# Altium project EEG.PrjPCB
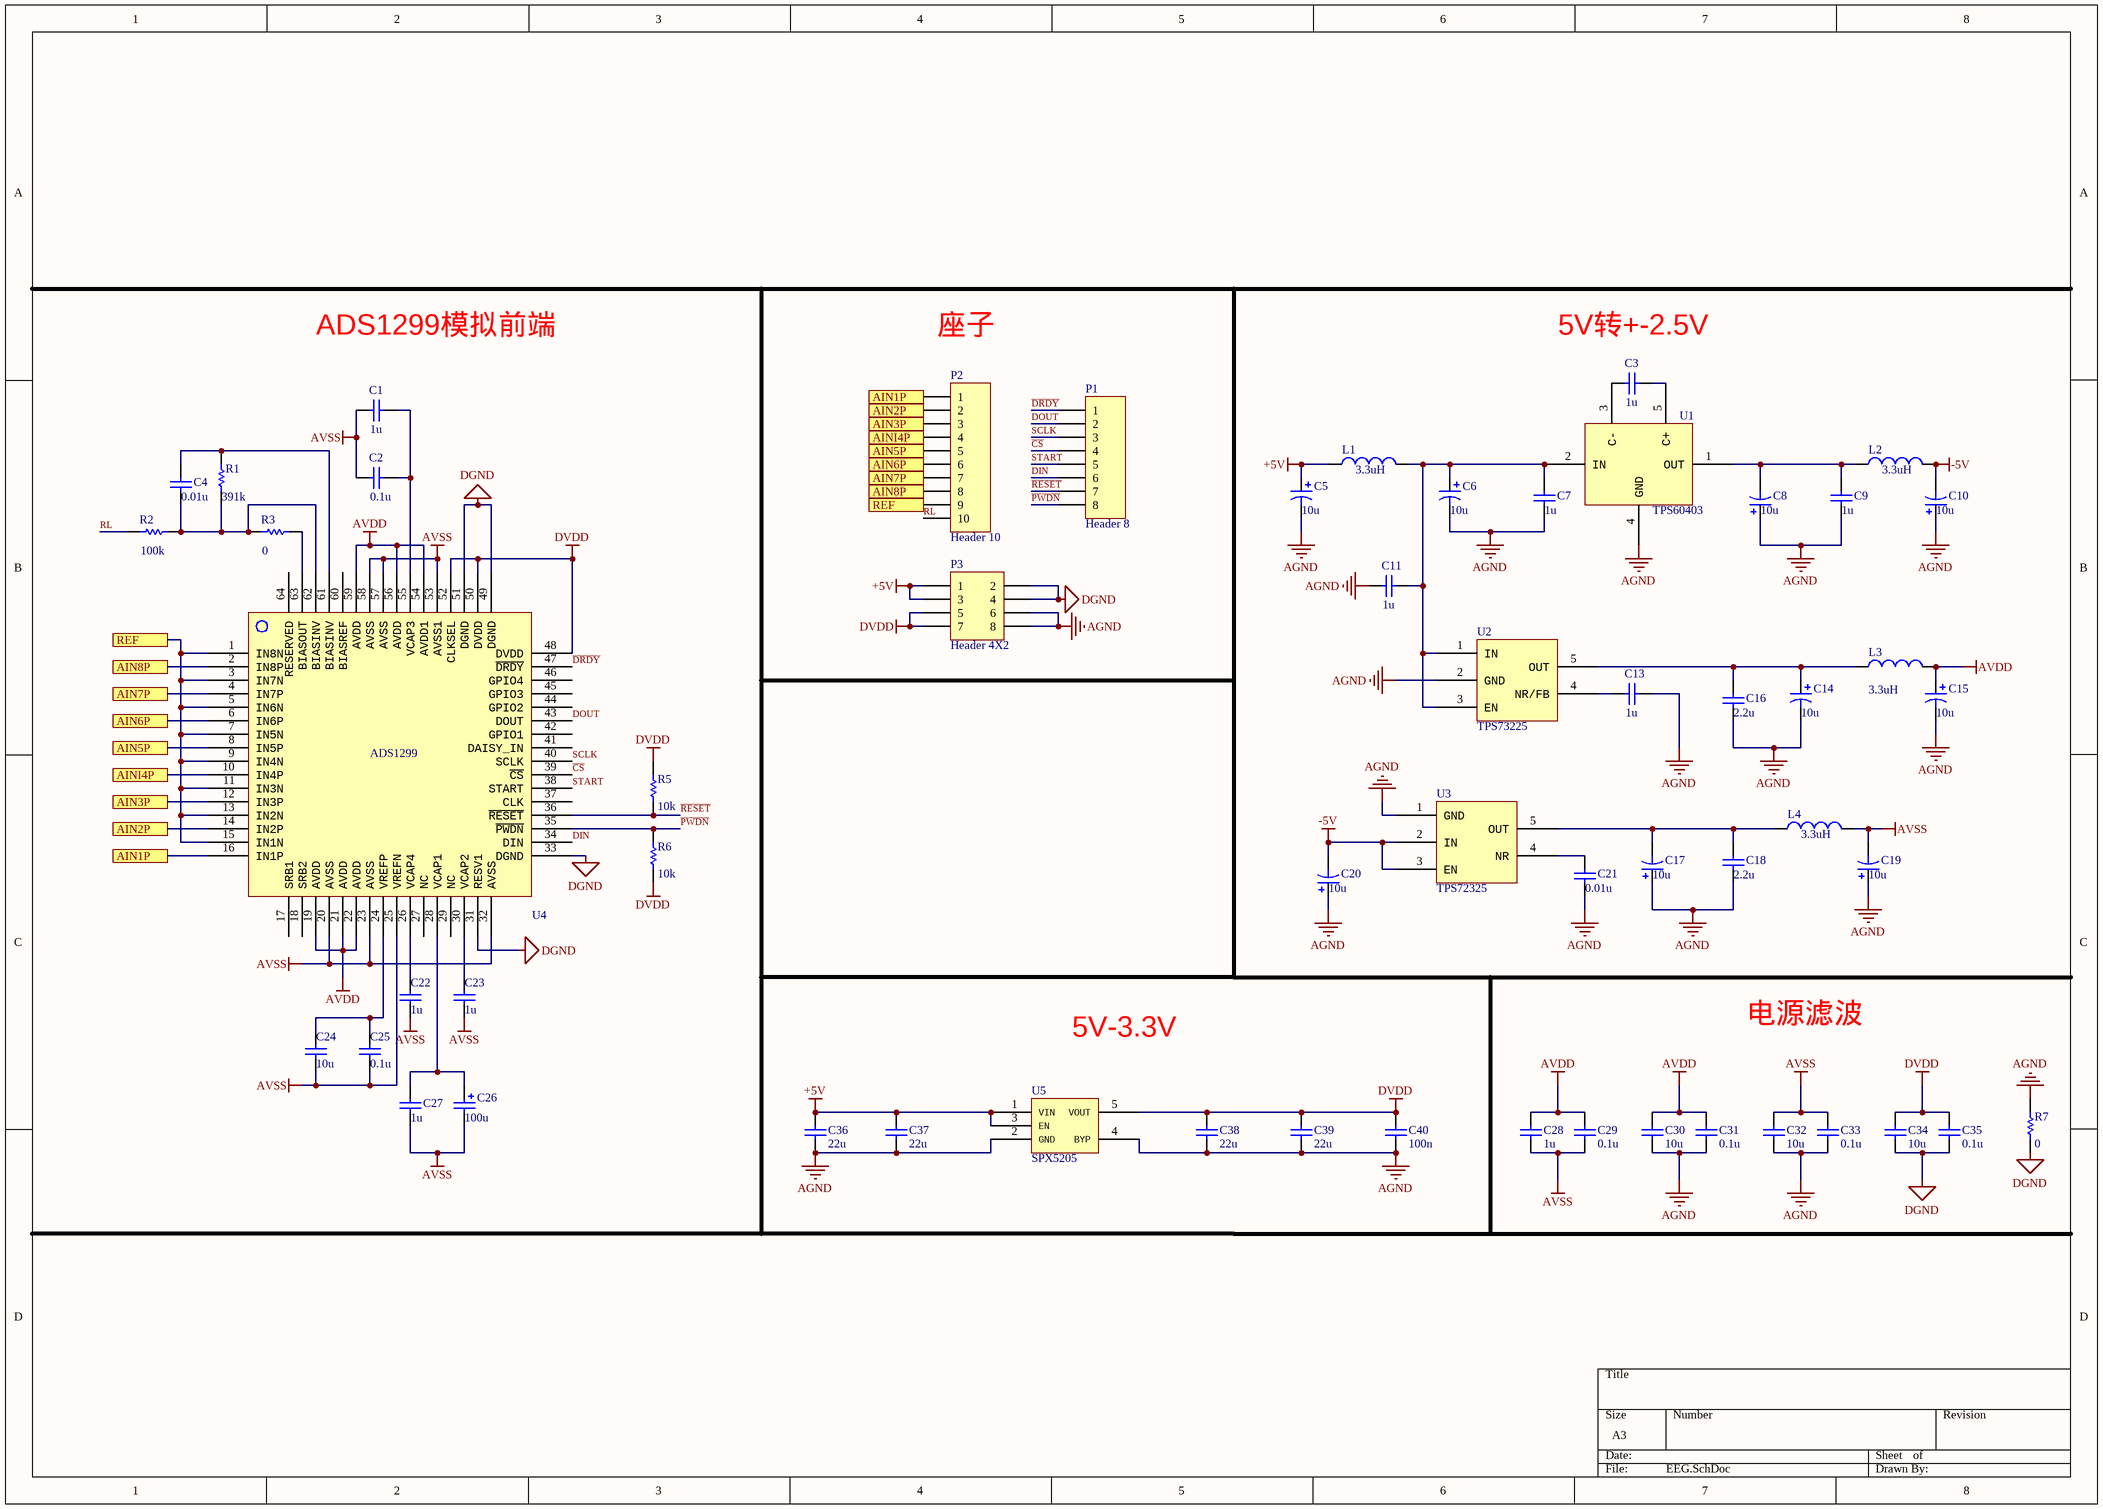
[diagram p0: EEG.SchDoc]
1 sheet, 57 parts. Net scope: flat (ports and power ports of the same name join across sheets).
Board file: EEG.PcbDoc

## Sheet EEG.SchDoc
size A3

### Parts
C1  value 1u  [0603-1]  (hidden comment: Cap)
C2  value 0.1u  [0603-1]  (hidden comment: Cap)
C3  value 1u  [0603-1]  (hidden comment: Cap)
C4  value 0.01u  [0603-1]  (hidden comment: Cap)
C5  value 10u  [0603-1]  (hidden comment: Cap Pol1)
C6  value 10u  [0603-1]  (hidden comment: Cap Pol1)
C7  value 1u  [0603-1]  (hidden comment: Cap)
C8  value 10u  [0603-1]  (hidden comment: Cap Pol1)
C9  value 1u  [0603-1]  (hidden comment: Cap)
C10  value 10u  [0603-1]  (hidden comment: Cap Pol1)
C11  value 1u  [0603-1]  (hidden comment: Cap)
C13  value 1u  [0603-1]  (hidden comment: Cap)
C14  value 10u  [0603-1]  (hidden comment: Cap Pol1)
C15  value 10u  [0603-1]  (hidden comment: Cap Pol1)
C16  value 2.2u  [0603-1]  (hidden comment: Cap)
C17  value 10u  [0603-1]  (hidden comment: Cap Pol1)
C18  value 2.2u  [0603-1]  (hidden comment: Cap)
C19  value 10u  [0603-1]  (hidden comment: Cap Pol1)
C20  value 10u  [0603-1]  (hidden comment: Cap Pol1)
C21  value 0.01u  [0603-1]  (hidden comment: Cap)
C22  value 1u  [0603-1]  (hidden comment: Cap)
C23  value 1u  [0603-1]  (hidden comment: Cap)
C24  value 10u  [0603-1]  (hidden comment: Cap)
C25  value 0.1u  [0603-1]  (hidden comment: Cap)
C26  value 100u  [0603-1]  (hidden comment: Cap Pol2)
C27  value 1u  [0603-1]  (hidden comment: Cap)
C28  value 1u  [0603-1]  (hidden comment: Cap)
C29  value 0.1u  [0603-1]  (hidden comment: Cap)
C30  value 10u  [0603-1]  (hidden comment: Cap)
C31  value 0.1u  [0603-1]  (hidden comment: Cap)
C32  value 10u  [0603-1]  (hidden comment: Cap)
C33  value 0.1u  [0603-1]  (hidden comment: Cap)
C34  value 10u  [0603-1]  (hidden comment: Cap)
C35  value 0.1u  [0603-1]  (hidden comment: Cap)
C36  value 22u  [0603-1]  (hidden comment: Cap)
C37  value 22u  [0603-1]  (hidden comment: Cap)
C38  value 22u  [0603-1]  (hidden comment: Cap)
C39  value 22u  [0603-1]  (hidden comment: Cap)
C40  value 100n  [0603-1]  (hidden comment: Cap)
L1  value 3.3uH  [L-SMD-7]  (hidden comment: Inductor)
L2  value 3.3uH  [L-SMD-7]  (hidden comment: Inductor)
L3  value 3.3uH  [L-SMD-7]  (hidden comment: Inductor)
L4  value 3.3uH  [L-SMD-7]  (hidden comment: Inductor)
P1  Header 8  [HDR1X8]
P2  Header 10  [HDR1X10]
P3  Header 4X2  [HDR2X4]
R1  value 391k  [0603-1]  (hidden comment: Res1)
R2  value 100k  [0603-1]  (hidden comment: Res1)
R3  value 0  [0603-1]  (hidden comment: Res1)
R5  value 10k  [0603-1]  (hidden comment: Res1)
R6  value 10k  [0603-1]  (hidden comment: Res1)
R7  value 0  [0603-1]  (hidden comment: Res1)
U1  TPS60403  [tps723/732/60403]
U2  TPS73225  [tps723/732/60403]
U3  TPS72325  [tps723/732/60403]
U4  ADS1299  [ADS1299]
U5  SPX5205  [SPX5205]

### Ports
AIN1P, AIN2P, AIN3P, AIN5P, AIN6P, AIN7P, AIN8P, AINI4P, REF

### Nets
+5V: C5.1 C36.1 C37.1 L1.1 P3.1 P3.3 U5.1(VIN) U5.3(EN)
-5V: C10.2 C20.2 L2.2 U3.2(IN) U3.3(EN)
AGND: C5.2 C6.2 C7.1 C8.1 C9.1 C10.1 C11.1 C13.2 C14.2 C15.2 C16.1 C17.1 C18.1 C19.1 C20.1 C21.1 C30.2 C31.2 C32.2 C33.2 C36.2 C37.2 C38.2 C39.2 C40.2 P3.6 P3.8 R7.2 U1.4(GND) U2.2(GND) U3.1(GND) U5.2(GND) U5.4(BYP)
AVDD: C15.1 C28.1 C29.1 C30.1 C31.1 L3.2 U4.19(AVDD) U4.21(AVDD) U4.22(AVDD) U4.54(AVDD1) U4.56(AVDD) U4.59(AVDD)
AVSS: C1.1 C2.1 C19.2 C22.1 C23.1 C24.1 C25.1 C26.2 C27.1 C28.2 C29.2 C32.1 C33.1 L4.2 U4.20(AVSS) U4.23(AVSS) U4.25(VREFN) U4.32(AVSS) U4.53(AVSS1) U4.57(AVSS) U4.58(AVSS)
DGND: C34.2 C35.2 P3.2 P3.4 R7.1 U4.31(RESV1) U4.33(DGND) U4.49(DGND) U4.51(DGND)
DVDD: C34.1 C35.1 C38.1 C39.1 C40.1 P3.5 P3.7 R5.2 R6.1 U4.48(DVDD) U4.50(DVDD) U4.52(CLKSEL) U5.5(VOUT)
~{CS}: P1.4 U4.39(~{CS})
~{DRDY}: P1.1 U4.47(~{DRDY})
DIN: P1.6 U4.34(DIN)
DOUT: P1.2 U4.43(DOUT)
~{PWDN}: P1.8 R6.2 U4.35(~{PWDN})
~{RESET}: P1.7 R5.1 U4.36(~{RESET})
RL: P2.10 R2.1
SCLK: P1.3 U4.40(SCLK)
START: P1.5 U4.38(START)
NetC1_2: C1.2 C2.2 U4.55(VCAP3)
NetC3_1: C3.1 U1.3(C-)
NetC3_2: C3.2 U1.5(C+)
NetC4_1: C4.1 R1.1 R2.2 R3.1 U4.62(BIASINV)
NetC4_2: C4.2 R1.2 U4.61(BIASINV)
NetC6_1: C6.1 C7.2 C11.2 L1.2 U1.2(IN) U2.1(IN) U2.3(EN)
NetC8_2: C8.2 C9.2 L2.1 U1.1(OUT)
NetC13_1: C13.1 U2.4(NR/FB)
NetC14_1: C14.1 C16.2 L3.1 U2.5(OUT)
NetC17_2: C17.2 C18.2 L4.1 U3.5(OUT)
NetC21_2: C21.2 U3.4(NR)
NetC22_2: C22.2 U4.26(VCAP4)
NetC23_2: C23.2 U4.30(VCAP2)
NetC24_2: C24.2 C25.2 U4.24(VREFP)
NetC26_1: C26.1 C27.2 U4.28(VCAP1)
NetP2_1: P2.1 U4.16(IN1P) ; port AIN1P
NetP2_2: P2.2 U4.14(IN2P) ; port AIN2P
NetP2_3: P2.3 U4.12(IN3P) ; port AIN3P
NetP2_4: P2.4 U4.10(IN4P) ; port AINI4P
NetP2_5: P2.5 U4.8(IN5P) ; port AIN5P
NetP2_6: P2.6 U4.6(IN6P) ; port AIN6P
NetP2_7: P2.7 U4.4(IN7P) ; port AIN7P
NetP2_8: P2.8 U4.2(IN8P) ; port AIN8P
NetP2_9: P2.9 U4.1(IN8N) U4.3(IN7N) U4.5(IN6N) U4.7(IN5N) U4.9(IN4N) U4.11(IN3N) U4.13(IN2N) U4.15(IN1N) ; port REF
NetR3_2: R3.2 U4.63(BIASOUT)

Not connected (* = marked no-connect by the designer): U4 17(SRB1) 18(SRB2) 27(NC) 29(NC) 37(CLK) 41(DAISY_IN) 42(GPIO1) 44(GPIO2) 45(GPIO3) 46(GPIO4) 60(BIASREF) 64(RESERVED)

### Notes on the sheet
- ADS1299模拟前端
- 座子
- (near C3) 5V转+-2.5V
- 5V-3.3V
- 电源滤波

### Library data of the parts
C1-C4 C7 C9 C11 C13 C16 C18 C21-C25 C27-C40 = Cap: Capacitor; Published: 8-Jun-2000; LatestRevisionDate: 17-Jul-2002; LatestRevisionNote: Re-released for DXP Platform.; PackageReference: RAD-0.3; Publisher: Altium Limited; PackageDescription: Radial Cap, Thru-Hole; 2 Leads; 0.3 in Pin Spacing
C5 C6 C8 C10 C14 C15 C17 C19 C20 = Cap Pol1: Polarized Capacitor (Radial); Published: 8-Jun-2000; LatestRevisionDate: 17-Jul-2002; LatestRevisionNote: Re-released for DXP Platform.; PackageReference: RB7.6-15; Publisher: Altium Limited; PackageDescription: Polarized Capacitor (Radial); 2 Leads
C26 = Cap Pol2: Polarized Capacitor (Axial); Published: 8-Jun-2000; LatestRevisionDate: 17-Jul-2002; LatestRevisionNote: Re-released for DXP Platform.; PackageReference: POLAR0.8; Publisher: Altium Limited; PackageDescription: Polarized Capacitor; 2 Leads
L1-L4 = Inductor: Code_IEC: 1005; Published: 8-Jun-2000; LatestRevisionDate: 29-May-2009; LatestRevisionNote: IPC-7351 Footprint Added.; PackageReference: 0402-A; Publisher: Altium Limited; PackageDescription: Chip Inductor; Code_JEITA: 0402
P1 = Header 8: Header, 8-Pin; LatestRevisionDate: 17-Jul-2002; LatestRevisionNote: Re-released for DXP Platform.; Publisher: Altium Limited
P2 = Header 10: Header, 10-Pin; LatestRevisionDate: 17-Jul-2002; LatestRevisionNote: Re-released for DXP Platform.; Publisher: Altium Limited
P3 = Header 4X2: Header, 4-Pin, Dual row; LatestRevisionDate: 17-Jul-2002; LatestRevisionNote: Re-released for DXP Platform.; Publisher: Altium Limited
R1-R3 R5-R7 = Res1: Resistor; Published: 8-Jun-2000; LatestRevisionDate: 17-Jul-2002; LatestRevisionNote: Re-released for DXP Platform.; PackageReference: AXIAL-0.3; Publisher: Altium Limited; PackageDescription: Axial Device, Thru-Hole; 2 Leads; 0.3 in Pin Spacing